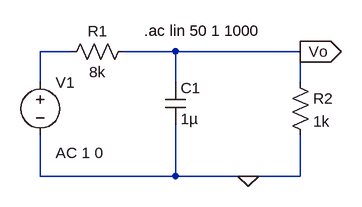
[diagram p0: schematic passive-filter-low-with-load.asc]
passive-filter-low-with-load.asc, the LTspice schematic file:
Version 4
SHEET 1 880 680
WIRE 16 128 -32 128
WIRE 176 128 96 128
WIRE 368 128 176 128
WIRE -32 176 -32 128
WIRE 176 176 176 128
WIRE 368 176 368 128
WIRE -32 320 -32 256
WIRE 176 320 176 240
WIRE 176 320 -32 320
WIRE 288 320 176 320
WIRE 368 320 368 256
WIRE 368 320 288 320
FLAG 288 320 0
FLAG 368 128 Vo
IOPIN 368 128 Out
SYMBOL res 0 144 R270
WINDOW 0 32 56 VTop 2
WINDOW 3 0 56 VBottom 2
SYMATTR InstName R1
SYMATTR Value 8k
SYMBOL res 352 160 R0
SYMATTR InstName R2
SYMATTR Value 1k
SYMBOL cap 160 176 R0
SYMATTR InstName C1
SYMATTR Value 1µ
SYMBOL voltage -32 160 R0
WINDOW 123 24 124 Left 2
WINDOW 39 0 0 Left 2
SYMATTR Value2 AC 1 0
SYMATTR InstName V1
SYMATTR Value ""
TEXT 128 96 Left 2 !.ac lin 50 1 1000

The netlist it stands for:
* passive-filter-low-with-load.asc
R1 N001 Vo 8k
R2 Vo 0 1k
C1 Vo 0 1µ
V1 N001 0 AC 1 0
.ac lin 50 1 1000
.backanno
.end